# Altium schematic sheet Killswitch.SchDoc
size A; SheetNumber: 4; SheetTotal: 4
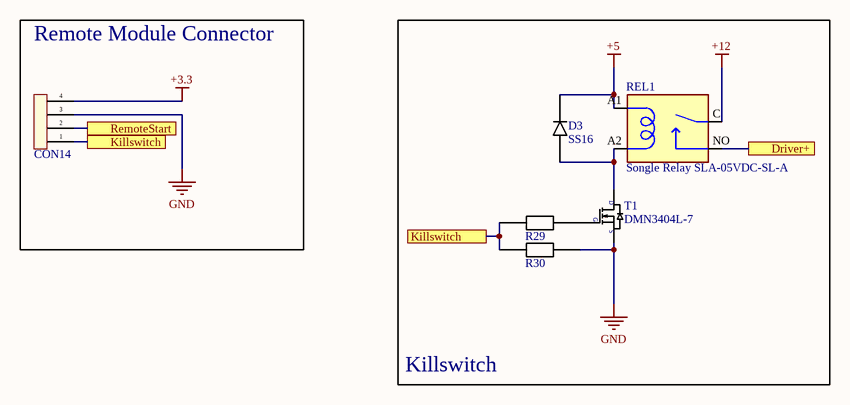
[diagram p0: Killswitch.SchDoc]

## Parts
CON14  1x4 2.54mm THT  [CON_1x4_2.54MM_THT]  (value not drawn)
D3  SS16  [DO-214AC]
R29  470  [RES_0805]  (value not drawn)
R30  4k7  [RES_0805]  (value not drawn)
REL1  Songle Relay SLA-05VDC-SL-A  [TE_1-1393210-3]
T1  DMN3404L-7  [SOT23-3]

## Blocks framed on the sheet
Remote Module Connector: CON14
Killswitch: D3 R29 R30 REL1 T1

## Ports
Driver+ (see Interface[1D]), Killswitch (see Killswitch[2B]), Killswitch (see Killswitch[3C]), RemoteStart (see MCU[4A])

## Nets
+3.3: CON14.4
+5: D3.1 REL1.A1
+12: REL1.C
GND: CON14.3 R30.2 T1.2
Driver+: REL1.NO ; port Driver+
Killswitch: CON14.1 R29.1 R30.1 ; port Killswitch
RemoteStart: CON14.2 ; port RemoteStart
NetD3_2: D3.2 REL1.A2 T1.3
NetR29_2: R29.2 T1.1

## Notes on the sheet
- (in symbol DMN3404L-7) D; G; S

## Library data of the parts
CON14 = CON_1x4_2.54mm_THT: note: any manufacturer; val: 1x4 2.54mm THT
D3 = SS16: Independent 60V 700mV@1A 1A SMA(DO-214AC) Single Diodes RoHS; note: any manufacturer; val: SS16; sample link: https://www.lcsc.com/product-detail/Schottky-Barrier-Diodes-SBD_GOODWORK-SS16_C2943739.html
R29 R30 = RES_0805: note: any manufacturer
  R29: val: 470
  R30: val: 4k7
REL1 = SLA-05VDC-SL-A: RELAY POWER SPST-NO 30A 5V / Power Relay 1 Form A: 1A (SPST-NO) 5V Coil Through Hole,27.6x32mm; val: Songle Relay SLA-05VDC-SL-A; sample link: https://www.lcsc.com/product-detail/C250645.html
T1 = DMN3404L-7: N-Channel 30V 5.8A 1.4W Surface Mount SOT-23; note: Original; val: DMN3404L-7; sample link: https://www.lcsc.com/product-detail/MOSFETs_Diodes-Incorporated-DMN3404L-7_C155257.html